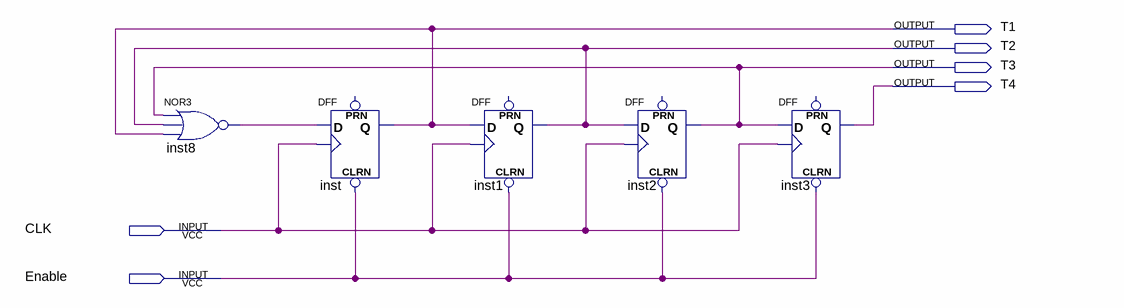
[diagram p0: schematic sheet]
// Quartus schematic PulsedGenerator.bdf as structural Verilog: 5 symbols, 6 pins
module PulsedGenerator (
  input  CLK,
  input  Enable,
  output T1,
  output T2,
  output T3,
  output T4
);

  wire inst8_out;

  nor inst8 (inst8_out, T3, T2, T1);
  DFF inst (.CLRN(Enable), .CLK(CLK), .D(inst8_out), .Q(T1));  // open: PRN
  DFF inst1 (.CLRN(Enable), .CLK(CLK), .D(T1), .Q(T2));  // open: PRN
  DFF inst2 (.CLRN(Enable), .CLK(CLK), .D(T2), .Q(T3));  // open: PRN
  DFF inst3 (.CLRN(Enable), .CLK(CLK), .D(T3), .Q(T4));  // open: PRN
endmodule
